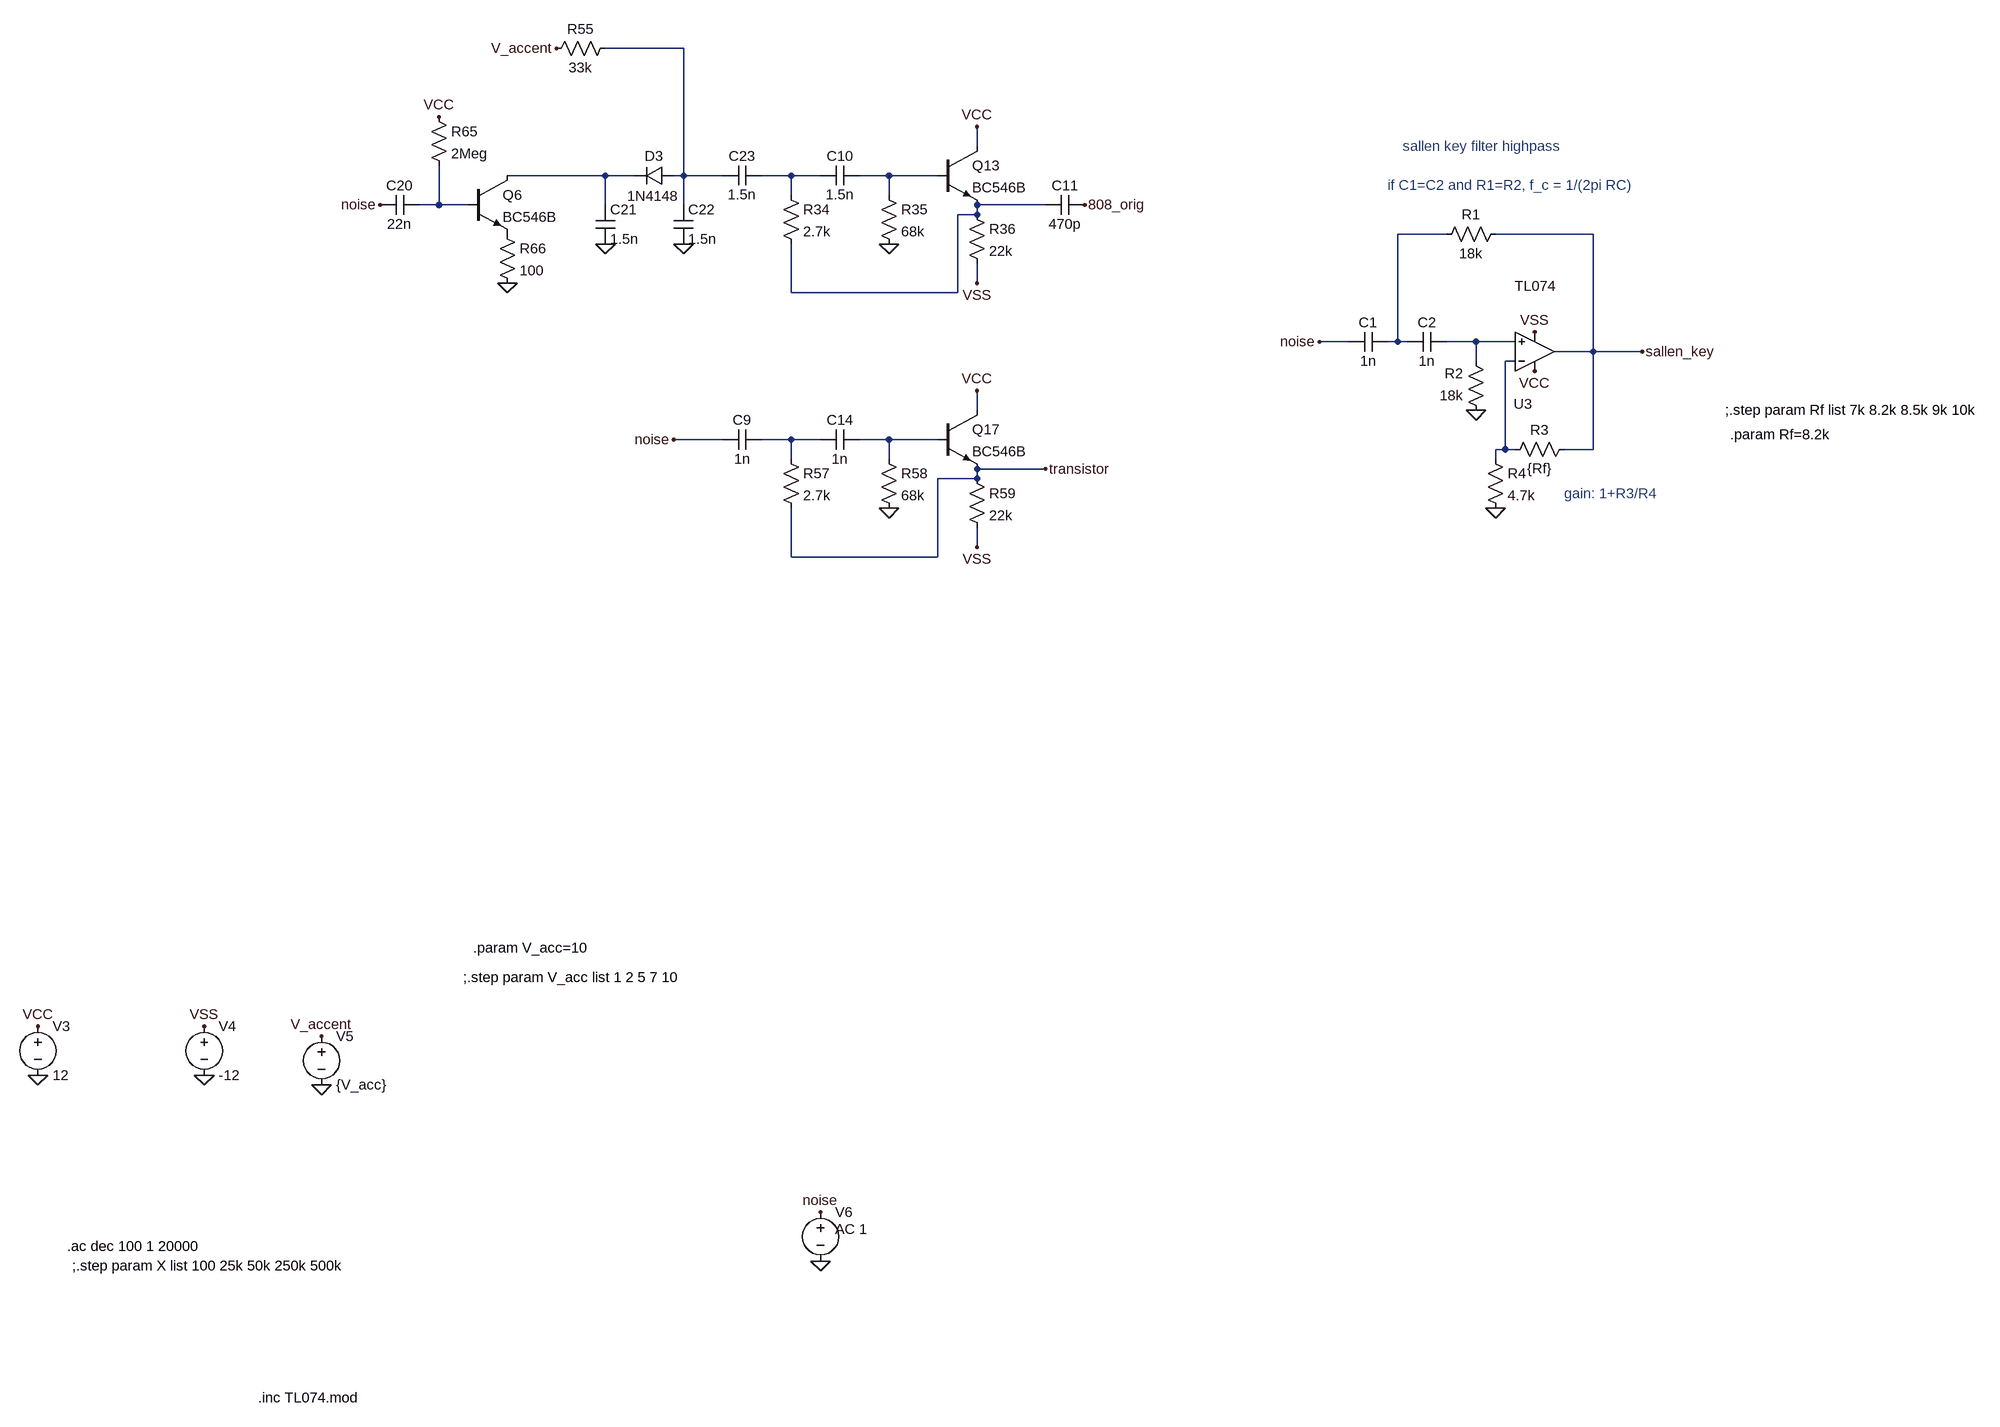
[diagram p0: schematic 808_filter_test_transistor_opamp.asc]
808_filter_test_transistor_opamp.asc, the LTspice schematic file:
Version 4
SHEET 1 5632 1784
WIRE 464 -752 336 -752
WIRE 944 -592 944 -624
WIRE 336 -544 176 -544
WIRE 384 -544 336 -544
WIRE 464 -544 464 -752
WIRE 464 -544 448 -544
WIRE 528 -544 464 -544
WIRE 640 -544 592 -544
WIRE 688 -544 640 -544
WIRE 800 -544 752 -544
WIRE 880 -544 800 -544
WIRE 640 -512 640 -544
WIRE 800 -512 800 -544
WIRE 64 -496 64 -560
WIRE 64 -496 32 -496
WIRE 112 -496 64 -496
WIRE 336 -496 336 -544
WIRE 464 -496 464 -544
WIRE 1056 -496 944 -496
WIRE 944 -480 944 -496
WIRE 944 -480 912 -480
WIRE 1712 -448 1632 -448
WIRE 1952 -448 1792 -448
WIRE 944 -368 944 -400
WIRE 640 -352 640 -432
WIRE 912 -352 912 -480
WIRE 912 -352 640 -352
WIRE 1552 -272 1504 -272
WIRE 1632 -272 1632 -448
WIRE 1632 -272 1616 -272
WIRE 1648 -272 1632 -272
WIRE 1760 -272 1712 -272
WIRE 1824 -272 1760 -272
WIRE 1952 -256 1952 -448
WIRE 1952 -256 1888 -256
WIRE 2032 -256 1952 -256
WIRE 1760 -240 1760 -272
WIRE 1824 -240 1808 -240
WIRE 944 -160 944 -192
WIRE 528 -112 448 -112
WIRE 640 -112 592 -112
WIRE 688 -112 640 -112
WIRE 800 -112 752 -112
WIRE 880 -112 800 -112
WIRE 1808 -96 1808 -240
WIRE 1808 -96 1792 -96
WIRE 1824 -96 1808 -96
WIRE 1952 -96 1952 -256
WIRE 1952 -96 1904 -96
WIRE 640 -80 640 -112
WIRE 800 -80 800 -112
WIRE 1792 -80 1792 -96
WIRE 1056 -64 944 -64
WIRE 944 -48 944 -64
WIRE 944 -48 880 -48
WIRE 944 64 944 32
WIRE 640 80 640 0
WIRE 880 80 880 -48
WIRE 880 80 640 80
FLAG -320 928 0
FLAG -592 928 0
FLAG -592 848 VCC
FLAG -320 848 VSS
FLAG -128 944 0
FLAG -128 864 V_accent
FLAG -32 -496 noise
FLAG 64 -640 VCC
FLAG 176 -368 0
FLAG 336 -432 0
FLAG 464 -432 0
FLAG 256 -752 V_accent
FLAG 448 -112 noise
FLAG 944 -624 VCC
FLAG 944 -368 VSS
FLAG 800 -432 0
FLAG 944 -192 VCC
FLAG 944 64 VSS
FLAG 800 0 0
FLAG 1056 -64 transistor
FLAG 688 1232 0
FLAG 688 1152 noise
FLAG 1856 -224 VCC
FLAG 1856 -288 VSS
FLAG 1504 -272 noise
FLAG 1792 0 0
FLAG 1760 -160 0
FLAG 2032 -256 sallen_key
FLAG 1120 -496 808_orig
SYMBOL voltage -592 832 R0
WINDOW 123 0 0 Left 0
WINDOW 39 0 0 Left 0
SYMATTR InstName V3
SYMATTR Value 12
SYMBOL voltage -320 832 R0
WINDOW 123 0 0 Left 0
WINDOW 39 0 0 Left 0
SYMATTR InstName V4
SYMATTR Value -12
SYMBOL voltage -128 848 R0
WINDOW 123 0 0 Left 0
WINDOW 39 0 0 Left 0
SYMATTR InstName V5
SYMATTR Value {V_acc}
SYMBOL res 352 -768 R90
WINDOW 0 0 56 VBottom 2
WINDOW 3 32 56 VTop 2
SYMATTR InstName R55
SYMATTR Value 33k
SYMBOL cap 32 -512 R90
WINDOW 0 0 32 VBottom 2
WINDOW 3 32 32 VTop 2
SYMATTR InstName C20
SYMATTR Value 22n
SYMBOL res 48 -656 R0
SYMATTR InstName R65
SYMATTR Value 2Meg
SYMBOL npn 112 -544 R0
SYMATTR InstName Q6
SYMATTR Value BC546B
SYMBOL res 160 -464 R0
SYMATTR InstName R66
SYMATTR Value 100
SYMBOL cap 320 -496 R0
SYMATTR InstName C21
SYMATTR Value 1.5n
SYMBOL cap 448 -496 R0
SYMATTR InstName C22
SYMATTR Value 1.5n
SYMBOL cap 592 -560 R90
WINDOW 0 0 32 VBottom 2
WINDOW 3 32 32 VTop 2
SYMATTR InstName C23
SYMATTR Value 1.5n
SYMBOL diode 448 -560 R90
WINDOW 0 0 32 VBottom 2
WINDOW 3 34 34 VTop 2
SYMATTR InstName D3
SYMATTR Value 1N4148
SYMBOL cap 592 -128 R90
WINDOW 0 0 32 VBottom 2
WINDOW 3 32 32 VTop 2
SYMATTR InstName C9
SYMATTR Value 1n
SYMBOL cap 752 -560 R90
WINDOW 0 0 32 VBottom 2
WINDOW 3 32 32 VTop 2
SYMATTR InstName C10
SYMATTR Value 1.5n
SYMBOL res 624 -528 R0
SYMATTR InstName R34
SYMATTR Value 2.7k
SYMBOL res 784 -528 R0
SYMATTR InstName R35
SYMATTR Value 68k
SYMBOL npn 880 -592 R0
SYMATTR InstName Q13
SYMATTR Value BC546B
SYMBOL res 928 -496 R0
SYMATTR InstName R36
SYMATTR Value 22k
SYMBOL cap 1120 -512 R90
WINDOW 0 0 32 VBottom 2
WINDOW 3 32 32 VTop 2
SYMATTR InstName C11
SYMATTR Value 470p
SYMBOL cap 752 -128 R90
WINDOW 0 0 32 VBottom 2
WINDOW 3 32 32 VTop 2
SYMATTR InstName C14
SYMATTR Value 1n
SYMBOL res 624 -96 R0
SYMATTR InstName R57
SYMATTR Value 2.7k
SYMBOL res 784 -96 R0
SYMATTR InstName R58
SYMATTR Value 68k
SYMBOL npn 880 -160 R0
SYMATTR InstName Q17
SYMATTR Value BC546B
SYMBOL res 928 -64 R0
SYMATTR InstName R59
SYMATTR Value 22k
SYMBOL voltage 688 1136 R0
WINDOW 123 0 0 Left 0
WINDOW 39 0 0 Left 0
WINDOW 3 24 44 Left 2
SYMATTR Value AC 1
SYMATTR InstName V6
SYMBOL Opamps\\opamp2 1856 -192 M180
WINDOW 0 -34 -22 Left 2
WINDOW 3 -33 171 Left 2
SYMATTR InstName U3
SYMATTR Value TL074
SYMBOL cap 1616 -288 R90
WINDOW 0 0 32 VBottom 2
WINDOW 3 32 32 VTop 2
SYMATTR InstName C1
SYMATTR Value 1n
SYMBOL cap 1712 -288 R90
WINDOW 0 0 32 VBottom 2
WINDOW 3 32 32 VTop 2
SYMATTR InstName C2
SYMATTR Value 1n
SYMBOL res 1808 -464 R90
WINDOW 0 0 56 VBottom 2
WINDOW 3 32 56 VTop 2
SYMATTR InstName R1
SYMATTR Value 18k
SYMBOL res 1776 -144 R180
WINDOW 0 36 76 Left 2
WINDOW 3 36 40 Left 2
SYMATTR InstName R2
SYMATTR Value 18k
SYMBOL res 1808 -80 R270
WINDOW 0 32 56 VTop 2
WINDOW 3 0 56 VBottom 2
SYMATTR InstName R3
SYMATTR Value {Rf}
SYMBOL res 1776 -96 R0
SYMATTR InstName R4
SYMATTR Value 4.7k
TEXT -544 1208 Left 2 !.ac dec 100 1 20000
TEXT -232 1456 Left 2 !.inc TL074.mod
TEXT -536 1240 Left 2 !;.step param X list 100 25k 50k 250k 500k
TEXT 104 768 Left 2 !;.step param V_acc list 1 2 5 7 10
TEXT 120 720 Left 2 !.param V_acc=10
TEXT 1640 -592 Left 2 ;sallen key filter highpass
TEXT 1904 -24 Left 2 ;gain: 1+R3/R4
TEXT 1616 -528 Left 2 ;if C1=C2 and R1=R2, f_c = 1/(2pi RC)
TEXT 2168 -160 Left 2 !;.step param Rf list 7k 8.2k 8.5k 9k 10k
TEXT 2176 -120 Left 2 !.param Rf=8.2k

The netlist it stands for:
* 808_filter_test_transistor_opamp.asc
V3 VCC 0 12
V4 VSS 0 -12
V5 V_accent 0 {V_acc}
R55 N001 V_accent 33k
C20 N005 noise 22n
R65 VCC N005 2Meg
Q6 N002 N005 P001 0 BC546B
R66 P001 0 100
C21 N002 0 1.5n
C22 N001 0 1.5n
C23 N003 N001 1.5n
D3 N001 N002 1N4148
C9 N010 noise 1n
C10 N004 N003 1.5n
R34 N003 N006 2.7k
R35 N004 0 68k
Q13 VCC N004 N006 0 BC546B
R36 N006 VSS 22k
C11 808_orig N006 470p
C14 N011 N010 1n
R57 N010 transistor 2.7k
R58 N011 0 68k
Q17 VCC N011 transistor 0 BC546B
R59 transistor VSS 22k
V6 noise 0 AC 1
XU3 N008 N009 VCC VSS sallen_key TL074  ; pins In+ In- V+ V- OUT
C1 N007 noise 1n
C2 N008 N007 1n
R1 sallen_key N007 18k
R2 0 N008 18k
R3 N009 sallen_key {Rf}
R4 N009 0 4.7k
.model D D
.lib standard.dio
.model NPN NPN
.model PNP PNP
.lib standard.bjt
.ac dec 100 1 20000
.inc TL074.mod
;.step param X list 100 25k 50k 250k 500k
;.step param V_acc list 1 2 5 7 10
.param V_acc=10
* sallen key filter highpass
* gain: 1+R3/R4
* if C1=C2 and R1=R2, f_c = 1/(2pi RC)
;.step param Rf list 7k 8.2k 8.5k 9k 10k
.param Rf=8.2k
.backanno
.end